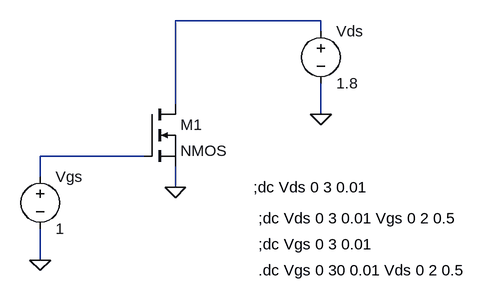
[diagram p0: schematic NMOS ytb.asc]
NMOS ytb.asc, the LTspice schematic file:
Version 4
SHEET 1 880 680
WIRE 400 0 176 0
WIRE 400 16 400 0
WIRE 176 128 176 0
WIRE 400 144 400 96
WIRE 128 208 -32 208
WIRE -32 240 -32 208
WIRE 176 256 176 224
WIRE -32 368 -32 320
FLAG 176 256 0
FLAG -32 368 0
FLAG 400 144 0
SYMBOL nmos 128 128 R0
SYMATTR InstName M1
SYMBOL voltage 400 0 R0
WINDOW 123 0 0 Left 0
WINDOW 39 0 0 Left 0
SYMATTR InstName Vds
SYMATTR Value 1.8
SYMBOL voltage -32 224 R0
WINDOW 123 0 0 Left 0
WINDOW 39 0 0 Left 0
SYMATTR InstName Vgs
SYMATTR Value 1
TEXT 296 256 Left 2 !;dc Vds 0 3 0.01
TEXT 304 304 Left 2 !;dc Vds 0 3 0.01 Vgs 0 2 0.5
TEXT 304 344 Left 2 !;dc Vgs 0 3 0.01
TEXT 304 384 Left 2 !.dc Vgs 0 30 0.01 Vds 0 2 0.5

The netlist it stands for:
* NMOS ytb.asc
M1 N001 N002 0 0 NMOS
Vds N001 0 1.8
Vgs N002 0 1
.model NMOS NMOS
.model PMOS PMOS
.lib standard.mos
;dc Vds 0 3 0.01
;dc Vds 0 3 0.01 Vgs 0 2 0.5
;dc Vgs 0 3 0.01
.dc Vgs 0 30 0.01 Vds 0 2 0.5
.backanno
.end